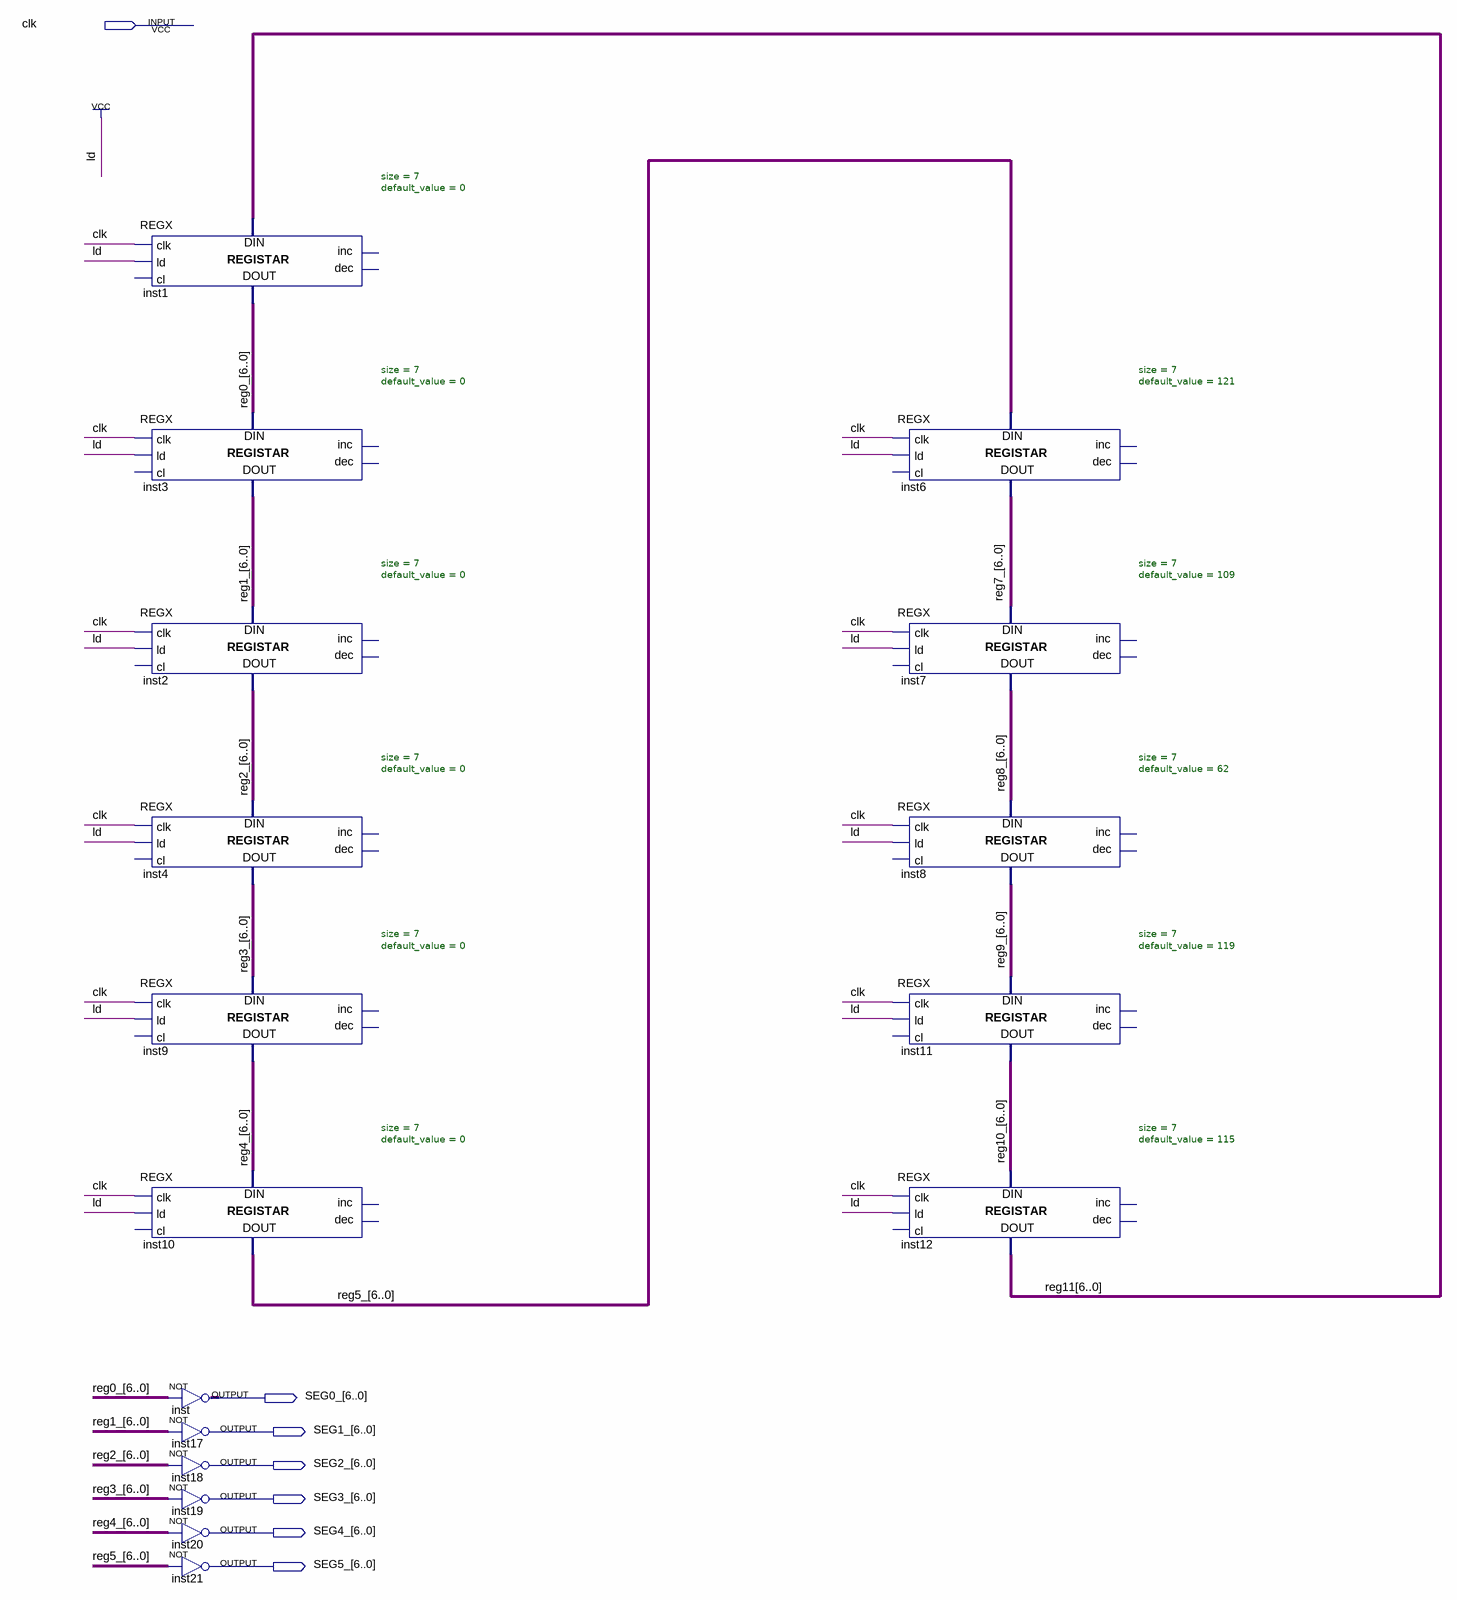
[diagram p0: schematic sheet]
// Quartus schematic pause.bdf as structural Verilog: 17 symbols, 7 pins
module pause (
  input  clk,
  output [6:0] SEG0_,
  output [6:0] SEG1_,
  output [6:0] SEG2_,
  output [6:0] SEG3_,
  output [6:0] SEG4_,
  output [6:0] SEG5_
);

  wire [6:0] reg0_, reg1_, reg2_, reg3_, reg4_, reg5_, reg7_, reg8_, reg9_, reg10_, reg11;

  REGX #(.size(7), .default_value(0)) inst1 (
    .clk(clk), .ld(1'b1), .data_in(reg11), .data_out(reg0_));  // open: cl, inc, dec
  REGX #(.size(7), .default_value(0)) inst3 (
    .clk(clk), .ld(1'b1), .data_in(reg0_), .data_out(reg1_));  // open: cl, inc, dec
  REGX #(.size(7), .default_value(0)) inst2 (
    .clk(clk), .ld(1'b1), .data_in(reg1_), .data_out(reg2_));  // open: cl, inc, dec
  REGX #(.size(7), .default_value(0)) inst4 (
    .clk(clk), .ld(1'b1), .data_in(reg2_), .data_out(reg3_));  // open: cl, inc, dec
  REGX #(.size(7), .default_value(0)) inst9 (
    .clk(clk), .ld(1'b1), .data_in(reg3_), .data_out(reg4_));  // open: cl, inc, dec
  REGX #(.size(7), .default_value(0)) inst10 (
    .clk(clk), .ld(1'b1), .data_in(reg4_), .data_out(reg5_));  // open: cl, inc, dec
  assign SEG0_ = ~reg0_;  // NOT inst, 7 bits wide
  assign SEG1_ = ~reg1_;  // NOT inst17, 7 bits wide
  assign SEG2_ = ~reg2_;  // NOT inst18, 7 bits wide
  assign SEG3_ = ~reg3_;  // NOT inst19, 7 bits wide
  assign SEG4_ = ~reg4_;  // NOT inst20, 7 bits wide
  assign SEG5_ = ~reg5_;  // NOT inst21, 7 bits wide
  REGX #(.size(7), .default_value(121)) inst6 (
    .clk(clk), .ld(1'b1), .data_in(reg5_), .data_out(reg7_));  // open: cl, inc, dec
  REGX #(.size(7), .default_value(109)) inst7 (
    .clk(clk), .ld(1'b1), .data_in(reg7_), .data_out(reg8_));  // open: cl, inc, dec
  REGX #(.size(7), .default_value(62)) inst8 (
    .clk(clk), .ld(1'b1), .data_in(reg8_), .data_out(reg9_));  // open: cl, inc, dec
  REGX #(.size(7), .default_value(119)) inst11 (
    .clk(clk), .ld(1'b1), .data_in(reg9_), .data_out(reg10_));  // open: cl, inc, dec
  REGX #(.size(7), .default_value(115)) inst12 (
    .clk(clk), .ld(1'b1), .data_in(reg10_), .data_out(reg11));  // open: cl, inc, dec
endmodule
